# EasyEDA schematic Bravo-M3-Memory.json
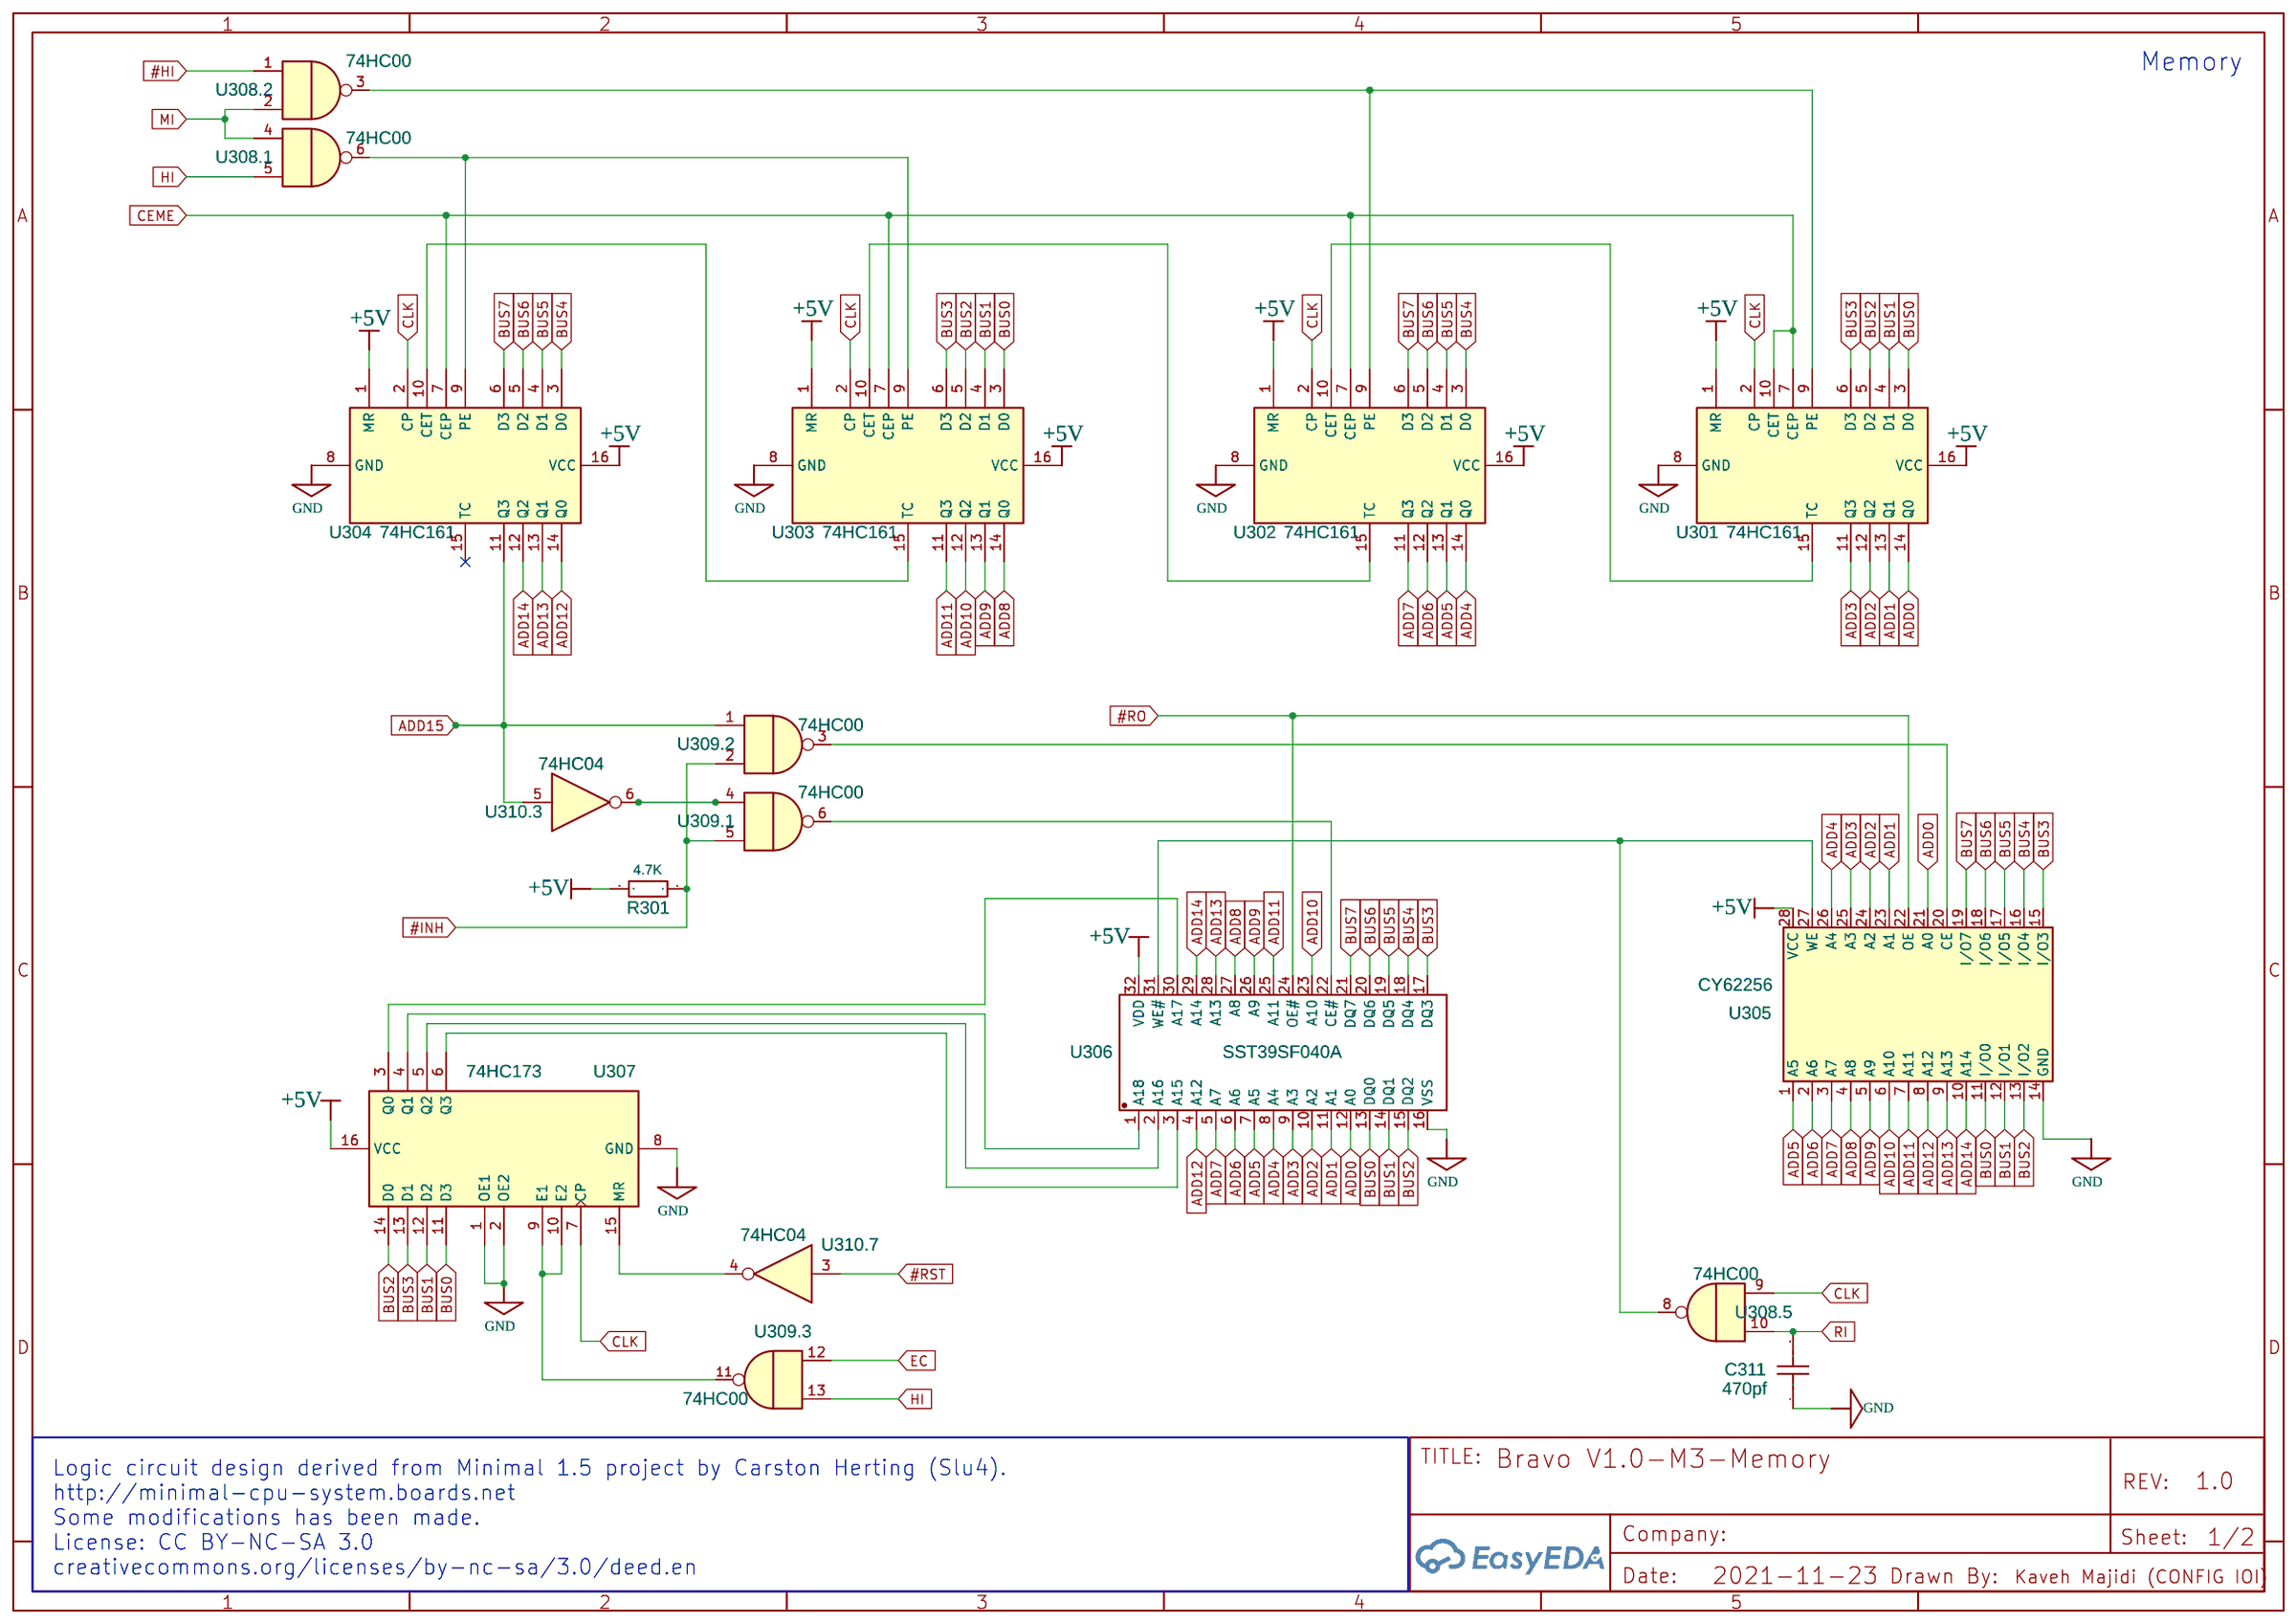
[diagram p0: schematic sheet]

## Parts
C311  470pf  [CAP-TH_L4.0-W2.5-P5.00-D1.0]
R301  4.7K  [AXIAL-0.4]
U301  74HC161  [DIP-16_W7.62MM_SOCKET]
U302  74HC161  [DIP-16_W7.62MM_SOCKET]
U303  74HC161  [DIP-16_W7.62MM_SOCKET]
U304  74HC161  [DIP-16_W7.62MM_SOCKET]
U305  CY62256  [PDIP-28_L37.0-W13.5-P2.54-LS15.6-BL]
U306  SST39SF040A  [PDIP-32_L42.0-W13.7-P2.54-LS15.2-BL]
U307  74HC173  [DIP-16_W7.62MM_SOCKET]
U308  74HC00  [DIP-14_W7.62MM_SOCKET]  (sections 1,2,5)
U309  74HC00  [DIP-14_W7.62MM_SOCKET]  (sections 1,2,3)
U310  74HC04  [DIP-14_W7.62MM_SOCKET]  (sections 3,7)

## Library data of the parts
C311 = CC45SL3AD220JYVNA: Supplier: LCSC; Supplier Part: C342429; Manufacturer: TDK; Contributor: LCSC
R301 = MF1/4W-10Ω±1% T52: Supplier: LCSC; Supplier Part: C119282; Manufacturer: Chian Chia Elec; Contributor: LCSC
U301-U304 = 74HC161: Contributor: Thiago Mendes
U305 = CY62256: Contributor: SegfaultCoder
U306 = SST39SF040-70-4C-PHE_C220176: Supplier: LCSC; Supplier Part: C220176; Manufacturer: Microchip Tech; Manufacturer Part: SST39SF040-70-4C-PHE; Contributor: LCSC; JLCPCB Part Class: Extended Part
U307 = 74HC173: Contributor: Vadim Bley
U308 U309 = 74HC00: Contributor: easyledas; subpart_no: 1
U310 = 74HC04: Contributor: Daniel_Wareham; subpart_no: 1

## Nets
+5V: R301.2 U301.1(MR) U301.16(VCC) U302.1(MR) U302.16(VCC) U303.1(MR) U303.16(VCC) U304.1(MR) U304.16(VCC) U305.28(VCC) U306.32(VDD) U307.16(VCC)
GND: C311.1 U301.8(GND) U302.8(GND) U303.8(GND) U304.8(GND) U305.14(GND) U306.16(VSS) U307.1(OE1) U307.2(OE2) U307.8(GND)
#HI: U308.1
#INH: R301.1 U309.2 U309.5
#RO: U305.22(OE) U306.24(OE#)
#RST: U310.3
ADD0: U301.14(Q0) U305.21(A0) U306.12(A0)
ADD1: U301.13(Q1) U305.23(A1) U306.11(A1)
ADD2: U301.12(Q2) U305.24(A2) U306.10(A2)
ADD3: U301.11(Q3) U305.25(A3) U306.9(A3)
ADD4: U302.14(Q0) U305.26(A4) U306.8(A4)
ADD5: U302.13(Q1) U305.1(A5) U306.7(A5)
ADD6: U302.12(Q2) U305.2(A6) U306.6(A6)
ADD7: U302.11(Q3) U305.3(A7) U306.5(A7)
ADD8: U303.14(Q0) U305.4(A8) U306.27(A8)
ADD9: U303.13(Q1) U305.5(A9) U306.26(A9)
ADD10: U303.12(Q2) U305.6(A10) U306.23(A10)
ADD11: U303.11(Q3) U305.7(A11) U306.25(A11)
ADD12: U304.14(Q0) U305.8(A12) U306.4(A12)
ADD13: U304.13(Q1) U305.9(A13) U306.28(A13)
ADD14: U304.12(Q2) U305.10(A14) U306.29(A14)
ADD15: U304.11(Q3) U309.1 U310.5
BUS0: U301.3(D0) U303.3(D0) U305.11(I/O0) U306.13(DQ0) U307.11(D3)
BUS1: U301.4(D1) U303.4(D1) U305.12(I/O1) U306.14(DQ1) U307.12(D2)
BUS2: U301.5(D2) U303.5(D2) U305.13(I/O2) U306.15(DQ2) U307.14(D0)
BUS3: U301.6(D3) U303.6(D3) U305.15(I/O3) U306.17(DQ3) U307.13(D1)
BUS4: U302.3(D0) U304.3(D0) U305.16(I/O4) U306.18(DQ4)
BUS5: U302.4(D1) U304.4(D1) U305.17(I/O5) U306.19(DQ5)
BUS6: U302.5(D2) U304.5(D2) U305.18(I/O6) U306.20(DQ6)
BUS7: U302.6(D3) U304.6(D3) U305.19(I/O7) U306.21(DQ7)
CEME: U301.7(CEP) U301.10(CET) U302.7(CEP) U303.7(CEP) U304.7(CEP)
CLK: U301.2(CP) U302.2(CP) U303.2(CP) U304.2(CP) U307.7(CP) U308.9
EC: U309.12
HI: U308.5 U309.13
MI: U308.2 U308.4
RI: C311.2 U308.10
Net-(U301-9): U301.9(PE) U302.9(PE) U308.3
Net-(U301-15): U301.15(TC) U302.10(CET)
Net-(U302-15): U302.15(TC) U303.10(CET)
Net-(U303-9): U303.9(PE) U304.9(PE) U308.6
Net-(U303-15): U303.15(TC) U304.10(CET)
Net-(U305-20): U305.20(CE) U309.3
Net-(U305-27): U305.27(WE) U306.31(WE#) U308.8
Net-(U306-1): U306.1(A18) U307.4(Q1)
Net-(U306-2): U306.2(A16) U307.5(Q2)
Net-(U306-3): U306.3(A15) U307.6(Q3)
Net-(U306-22): U306.22(CE#) U309.6
Net-(U306-30): U306.30(A17) U307.3(Q0)
Net-(U307-9): U307.9(E1) U307.10(E2) U309.11
Net-(U307-15): U307.15(MR) U310.4
Net-(U309.1-4): U309.4 U310.6

Not connected (* = marked no-connect by the designer): U304 15(TC)*

## Notes on the sheet
- Memory
- Logic circuit design derived from Minimal 1.5 project by Carston Herting (Slu4).
  http://minimal-cpu-system.boards.net
  Some modifications has been made.
  License: CC BY-NC-SA 3.0
  creativecommons.org/licenses/by-nc-sa/3.0/deed.en
